# EAGLE schematic PCB_control_glider_v21 (EAGLE 9.7.0)
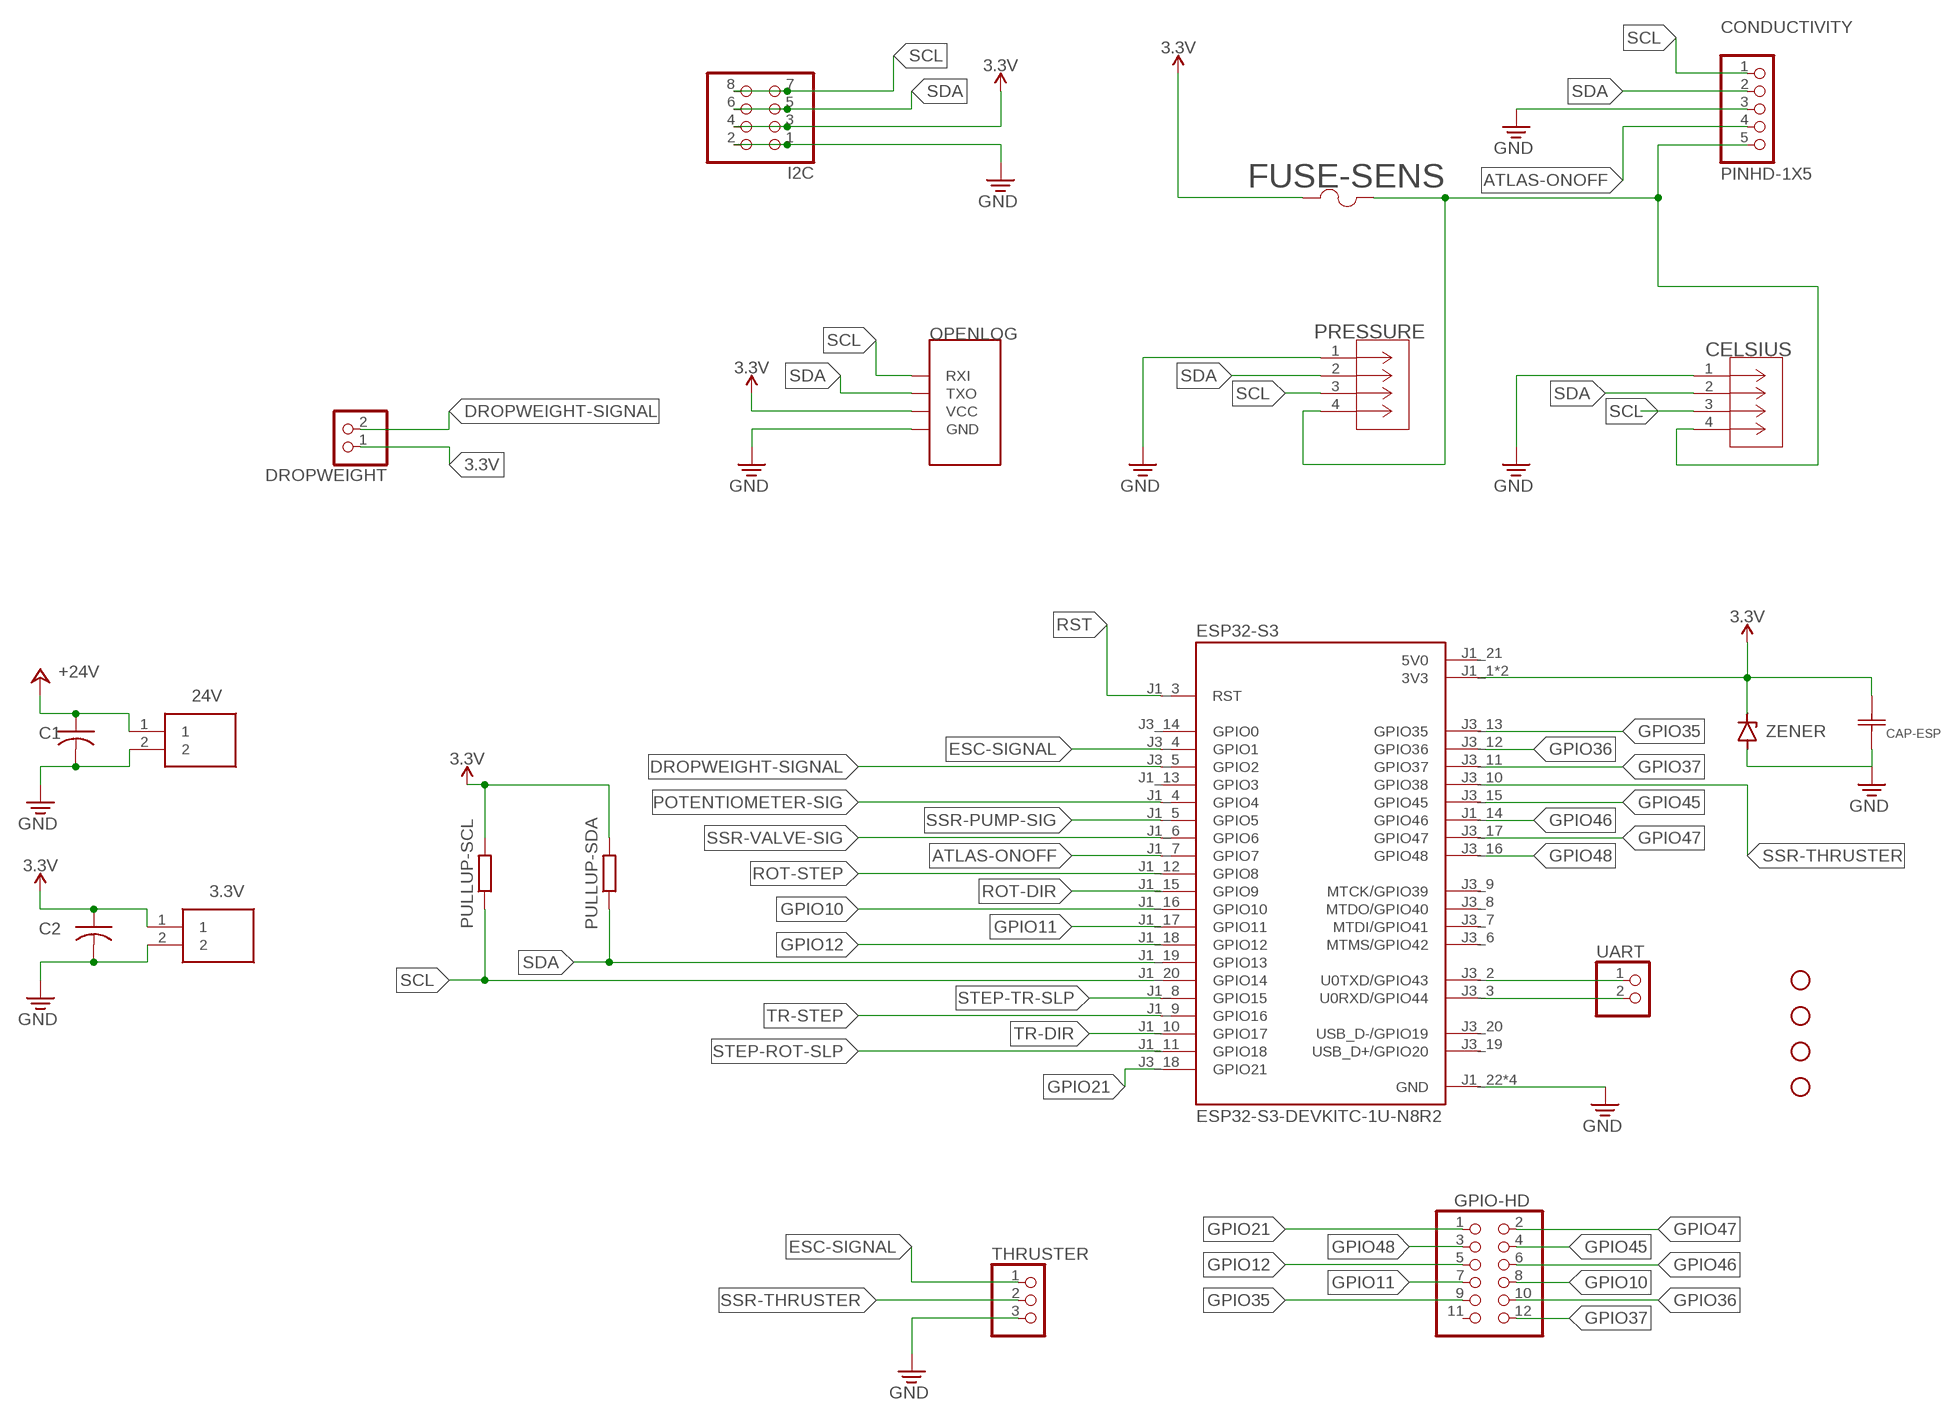
[diagram p0: schematic, sheet 1, part 1 of 2]
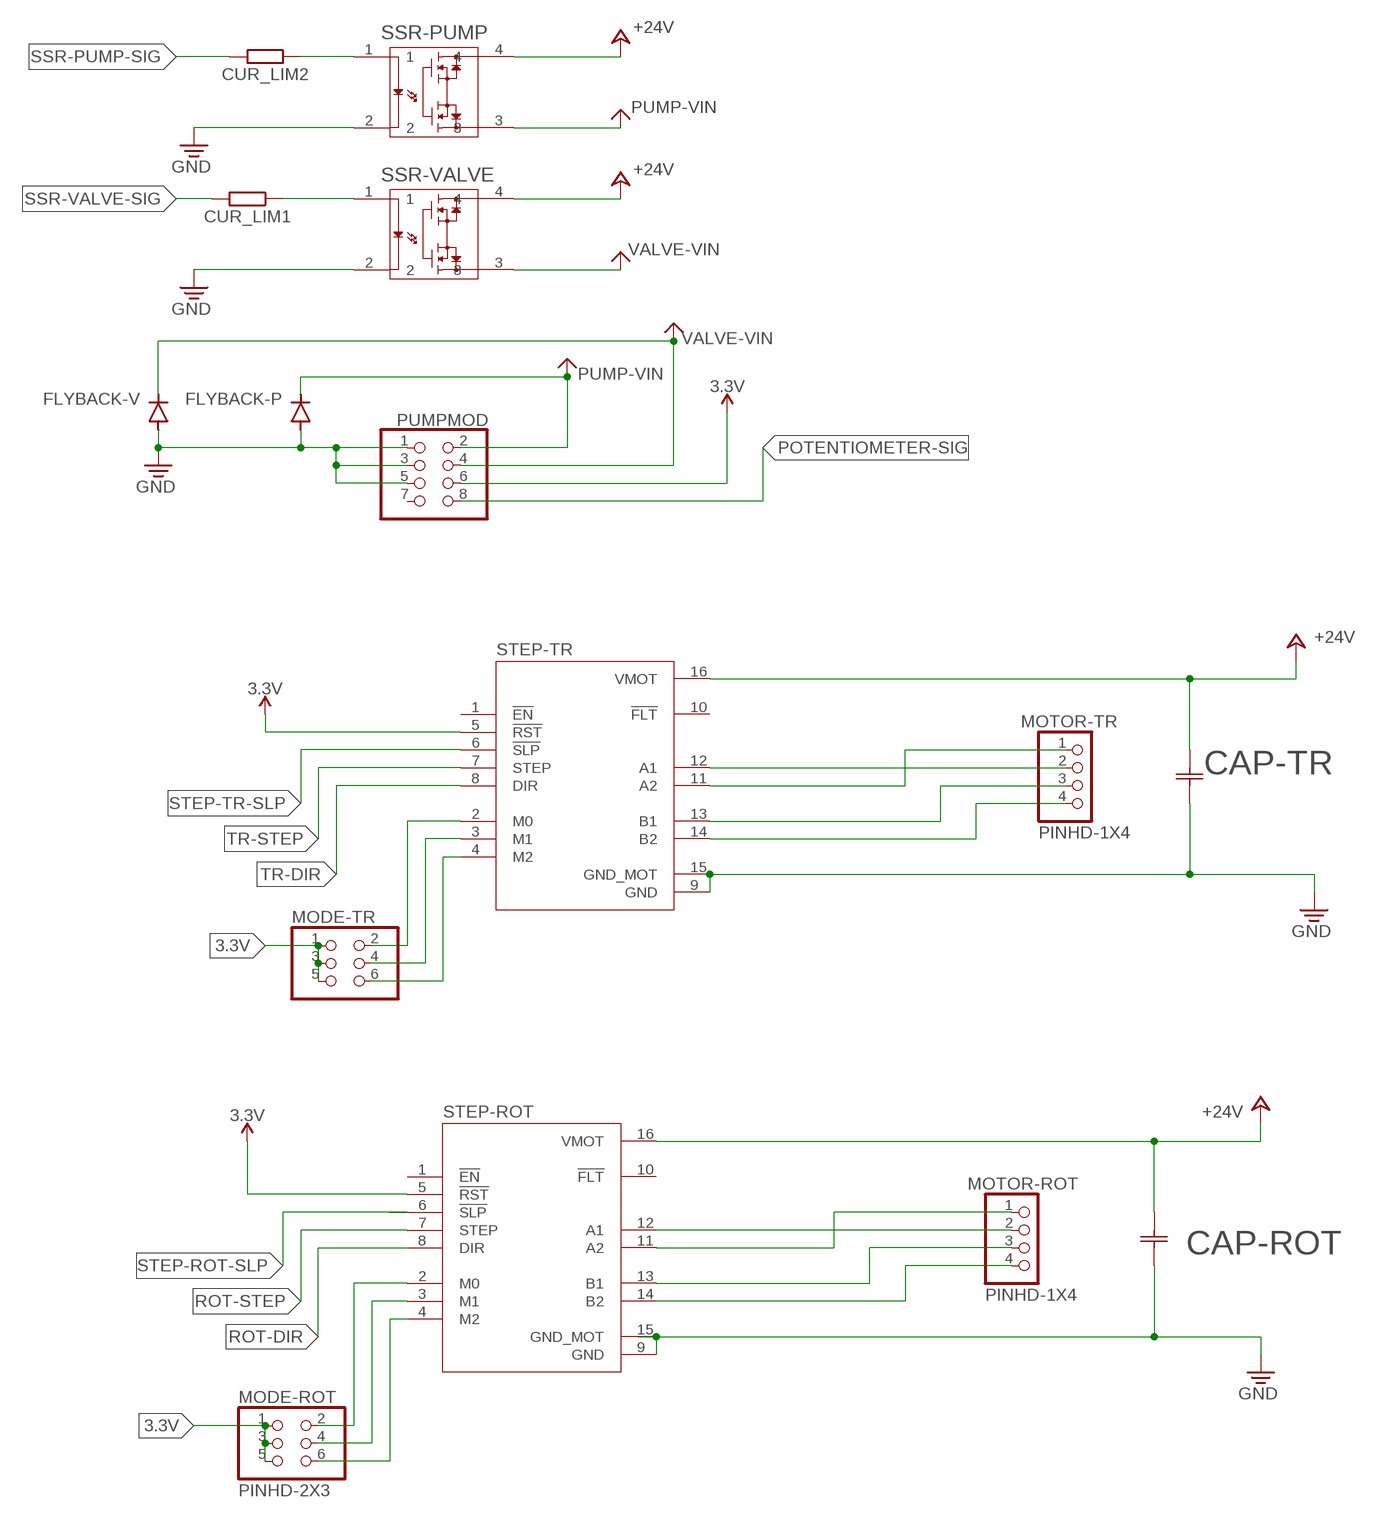
[diagram p1: schematic, sheet 1, part 2 of 2]

## Parts
3.3V  CTBP0508_2  [CTBP05082]
24V  CTBP0508_2  [CTBP05082]
C1  ECA-1HM100  [CAP_RADIAL_2MM]
C2  ECA-1HM100  [CAP_RADIAL_2MM]
CAP-ESP  EEUHD1H101BCAP_PAN_8X11.5_PAN  [CAP_PAN_8X11.5_PAN]
CAP-ROT  EEUHD1H101BCAP_PAN_8X11.5_PAN  [CAP_PAN_8X11.5_PAN]
CAP-TR  EEUHD1H101BCAP_PAN_8X11.5_PAN  [CAP_PAN_8X11.5_PAN]
CELSIUS  BM04B-GHS-TBTCONN_BM04B-GHS-TBT_JST  [CONN_BM04B-GHS-TBT_JST]
CONDUCTIVITY  PINHD-1X5  [1X05]
CUR_LIM1  RESISTOR-BACKUP_AXIAL-10.16MM-PITCH  [RESAD1016W63L850D250B]
CUR_LIM2  RESISTOR-BACKUP_AXIAL-10.16MM-PITCH  [RESAD1016W63L850D250B]
DROPWEIGHT  PINHD-1X2  [1X02]
ESP32-S3  ESP32-S3-DEVKITC-1U-N8R2  [XCVR_ESP32-S3-DEVKITC-1U-N8R2]
FLYBACK-P  1N4004  [DO-41]
FLYBACK-V  1N4004  [DO-41]
FUSE-SENS  LVR033KFUS_LVR033_TYCO_TYC  [FUS_LVR033_TYCO_TYC]
GPIO-HD  PINHD-2X6  [2X06]
H1  STAND-OFFTIGHT  [STAND-OFF-TIGHT]
H2  STAND-OFFTIGHT  [STAND-OFF-TIGHT]
H3  STAND-OFFTIGHT  [STAND-OFF-TIGHT]
H4  STAND-OFFTIGHT  [STAND-OFF-TIGHT]
I2C  PINHD-2X4  [2X04]
MODE-ROT  PINHD-2X3  [2X03]
MODE-TR  PINHD-2X3  [2X03]
MOTOR-ROT  PINHD-1X4  [1X04]
MOTOR-TR  PINHD-1X4  [1X04]
PRESSURE  BM04B-GHS-TBTCONN_BM04B-GHS-TBT_JST  [CONN_BM04B-GHS-TBT_JST]
PULLUP-SCL  RESISTOR-BACKUP_AXIAL-10.16MM-PITCH  [RESAD1016W63L850D250B]
PULLUP-SDA  RESISTOR-BACKUP_AXIAL-10.16MM-PITCH  [RESAD1016W63L850D250B]
PUMPMOD  PINHD-2X4  [2X04]
QWIIC-OPENLOG  OPENLOG  [OPENLOG]
SSR-PUMP  G3VM-61ARA-DIP4_THD_OMR  [A-DIP4_THD_OMR]
SSR-VALVE  G3VM-61ARA-DIP4_THD_OMR  [A-DIP4_THD_OMR]
STEP-ROT  DRV8825_STEPPER_MOTOR_DRIVER_CARRIER  [IC_DRV8825_STEPPER_MOTOR_DRIVER_CARRIER]
STEP-TR  DRV8825_STEPPER_MOTOR_DRIVER_CARRIER  [IC_DRV8825_STEPPER_MOTOR_DRIVER_CARRIER]
THRUSTER  PINHD-1X3  [1X03]
UART  PINHD-1X2  [1X02]
ZENER  ZENER_DIODE-AXIAL  [DIODE-AXIAL]

## Nets
3.3V: 3.3V.1 C2.1 CAP-ESP.1 DROPWEIGHT.1 ESP32-S3.J1_1(3V3) ESP32-S3.J1_2(3V3) FUSE-SENS.1 I2C.3 I2C.4 MODE-ROT.1 MODE-ROT.3 MODE-ROT.5 MODE-TR.1 MODE-TR.3 MODE-TR.5 PULLUP-SCL.2 PULLUP-SDA.2 PUMPMOD.6 QWIIC-OPENLOG.VCC STEP-ROT.5(!RST) STEP-TR.5(!RST) ZENER.2(C)
+24V: 24V.1 C1.1 CAP-ROT.1 CAP-TR.1 SSR-PUMP.4 SSR-VALVE.4 STEP-ROT.16(VMOT) STEP-TR.16(VMOT)
ATLAS-ONOFF: CONDUCTIVITY.4 ESP32-S3.J1_7(GPIO7)
DROPWEIGHT-SIGNAL: DROPWEIGHT.2 ESP32-S3.J3_5(GPIO2)
ESC-SIGNAL: ESP32-S3.J3_4(GPIO1) THRUSTER.1
GND [New Class]: 3.3V.2 24V.2 C1.2 C2.2 CAP-ESP.2 CAP-ROT.2 CAP-TR.2 CELSIUS.1 CONDUCTIVITY.3 ESP32-S3.J1_22(GND) ESP32-S3.J3_1(GND) ESP32-S3.J3_21(GND) ESP32-S3.J3_22(GND) FLYBACK-P.A FLYBACK-V.A I2C.1 I2C.2 PRESSURE.1 PUMPMOD.1 PUMPMOD.3 PUMPMOD.5 QWIIC-OPENLOG.GND SSR-PUMP.2 SSR-VALVE.2 STEP-ROT.9(GND) STEP-ROT.15(GND_MOT) STEP-TR.9(GND) STEP-TR.15(GND_MOT) THRUSTER.3 ZENER.1(A)
GPIO10: ESP32-S3.J1_16(GPIO10) GPIO-HD.8
GPIO11: ESP32-S3.J1_17(GPIO11) GPIO-HD.7
GPIO12: ESP32-S3.J1_18(GPIO12) GPIO-HD.5
GPIO21: ESP32-S3.J3_18(GPIO21) GPIO-HD.1
GPIO35: ESP32-S3.J3_13(GPIO35) GPIO-HD.9
GPIO36: ESP32-S3.J3_12(GPIO36) GPIO-HD.10
GPIO37: ESP32-S3.J3_11(GPIO37) GPIO-HD.12
GPIO45: ESP32-S3.J3_15(GPIO45) GPIO-HD.4
GPIO46: ESP32-S3.J1_14(GPIO46) GPIO-HD.6
GPIO47: ESP32-S3.J3_17(GPIO47) GPIO-HD.2
GPIO48: ESP32-S3.J3_16(GPIO48) GPIO-HD.3
N$1: ESP32-S3.J3_2(U0TXD/GPIO43) UART.1
N$3: ESP32-S3.J3_3(U0RXD/GPIO44) UART.2
N$4: MODE-TR.2 STEP-TR.2(M0)
N$5: MODE-TR.4 STEP-TR.3(M1)
N$6: MODE-TR.6 STEP-TR.4(M2)
N$7: CELSIUS.4 CONDUCTIVITY.5 FUSE-SENS.2 PRESSURE.4
N$8: MODE-ROT.2 STEP-ROT.2(M0)
N$10: MODE-ROT.6 STEP-ROT.4(M2)
N$12: MODE-ROT.4 STEP-ROT.3(M1)
N$13: CUR_LIM2.1 SSR-PUMP.1
N$14: CUR_LIM1.1 SSR-VALVE.1
POTENTIOMETER-SIG: ESP32-S3.J1_4(GPIO4) PUMPMOD.8
PUMP-VIN: FLYBACK-P.C PUMPMOD.2 SSR-PUMP.3
R-A1: MOTOR-ROT.2 STEP-ROT.12(A1)
R-A2: MOTOR-ROT.1 STEP-ROT.11(A2)
R-B1: MOTOR-ROT.3 STEP-ROT.13(B1)
R-B2: MOTOR-ROT.4 STEP-ROT.14(B2)
ROT-DIR: ESP32-S3.J1_15(GPIO9) STEP-ROT.8(DIR)
ROT-STEP: ESP32-S3.J1_12(GPIO8) STEP-ROT.7(STEP)
RST: ESP32-S3.J1_3(RST)
SCL: CELSIUS.3 CONDUCTIVITY.1 ESP32-S3.J1_20(GPIO14) I2C.7 I2C.8 PRESSURE.3 PULLUP-SCL.1 QWIIC-OPENLOG.RXI
SDA: CELSIUS.2 CONDUCTIVITY.2 ESP32-S3.J1_19(GPIO13) I2C.5 I2C.6 PRESSURE.2 PULLUP-SDA.1 QWIIC-OPENLOG.TXO
SSR-PUMP-SIG: CUR_LIM2.2 ESP32-S3.J1_5(GPIO5)
SSR-THRUSTER: ESP32-S3.J3_10(GPIO38) THRUSTER.2
SSR-VALVE-SIG: CUR_LIM1.2 ESP32-S3.J1_6(GPIO6)
STEP-ROT-SLP: ESP32-S3.J1_11(GPIO18) STEP-ROT.6(!SLP)
STEP-TR-SLP: ESP32-S3.J1_8(GPIO15) STEP-TR.6(!SLP)
T-A1: MOTOR-TR.2 STEP-TR.12(A1)
T-A2: MOTOR-TR.1 STEP-TR.11(A2)
T-B1: MOTOR-TR.3 STEP-TR.13(B1)
T-B2: MOTOR-TR.4 STEP-TR.14(B2)
TR-DIR: ESP32-S3.J1_10(GPIO17) STEP-TR.8(DIR)
TR-STEP: ESP32-S3.J1_9(GPIO16) STEP-TR.7(STEP)
VALVE-VIN: FLYBACK-V.C PUMPMOD.4 SSR-VALVE.3
Unconnected: ESP32-S3.J1_13(GPIO3) ESP32-S3.J3_6(MTMS/GPIO42) ESP32-S3.J3_7(MTDI/GPIO41) ESP32-S3.J3_8(MTDO/GPIO40) ESP32-S3.J3_9(MTCK/GPIO39) ESP32-S3.J3_14(GPIO0) ESP32-S3.J3_19(USB_D+/GPIO20) ESP32-S3.J3_20(USB_D-/GPIO19) GPIO-HD.11 PUMPMOD.7 STEP-ROT.1(!EN) STEP-ROT.10(!FLT) STEP-TR.1(!EN) STEP-TR.10(!FLT)

## Power pins joined to a net without a drawn wire
5V0: ESP32-S3.J1_21(5V0)

## Library data of the parts
3.3V 24V = CTBP0508_2:CTBP0508_2: Conn Terminal Block F 2 POS 5.08mm Solder ST Thru-Hole 8A Source: Datasheet <https://static6.arrow.com/aropdfconversion/9b5fc771929c7e0117b52de15994f93b42c84896/ctbp0508_series_d.pdf>; DESCRIPTION: Conn Terminal Block F 2 POS 5.08mm Solder ST Thru-Hole 8A; HEIGHT: 10.2mm; MANUFACTURER_NAME: CAMDENBOSS; MANUFACTURER_PART_NUMBER: CTBP0508/2
C1 C2 = Resistor_Capacitor:ECA-1HM100: CAP ALUM 10UF 20% 50V RADIAL Manufacturer's datasheet <https://media.digikey.com/pdf/Data%20Sheets/Panasonic%20Electronic%20Components/ECA-xxM%20Series,TypeA.pdf>; CREATED_BY: PCBLayout.com; DIGIKEY_PART_NUMBER: P5178-ND; MANUFACTURER: Panasonic Electronic Components; MPN: ECA-1HM100; PACKAGE: CAP RADIAL 2MM LS
CAP-ESP CAP-ROT CAP-TR = 100uf-50V-electrolytic_Library:EEUHD1H101B; COPYRIGHT: Copyright (C) 2024 Ultra Librarian. All rights reserved.; MANUFACTURER_PART_NUMBER: EEUHD1H101B; MFR_NAME: Panasonic
CELSIUS PRESSURE = BM04B_GHS_TBT_Library:BM04B-GHS-TBT; COPYRIGHT: Copyright (C) 2024 Ultra Librarian. All rights reserved.; MANUFACTURER_PART_NUMBER: BM04B-GHS-TBT; MFR_NAME: JST
CONDUCTIVITY = Connector:PINHD-1X5: PIN HEADER; CATEGORY: Headers; DESCRIPTION: Header, Straight, 5 Position; MANUFACTURER: Generic; MPN: Generic; OPERATING_TEMPERATURE: Generic; PART_STATUS: Active; PITCH: 0.100" (2.54mm); ROHS_COMPLIANCE: Generic; SERIES: Generic; SUB-CATEGORY: Headers, Male Pins; TYPE: Board to Board or Cable, Unshrouded, Through Hole, Straight
CUR_LIM1 CUR_LIM2 PULLUP-SCL PULLUP-SDA = Tinkercad:RESISTOR-BACKUP: Resistor Fixed - Generic
DROPWEIGHT UART = Airquality_Sensor:PINHD-1X2: PIN HEADER
ESP32-S3 = ESP32-S3-DEVKITC-1U-N8R2:ESP32-S3-DEVKITC-1U-N8R2: Check availability <https://pricing.snapeda.com/parts/ESP32-S3-DEVKITC-1U-N8R2/Espressif%20Systems/view-part?ref=eda>; AVAILABILITY: In Stock; CHECK_PRICES: https://www.snapeda.com/parts/ESP32-S3-DEVKITC-1U-N8R2/Espressif+Systems/view-part/?ref=eda; DESCRIPTION: WiFi Development Tools - 802.11 ESP32-S3 Gen-Purpose Dev Bd, embeds ESP32-S3-WROOM-1U-N8R2, 8 MB Quad Flash, 2 MB Quad PSRAM, IPEX antenna connector, w/ Pin Header; MF: Espressif Systems; MP: ESP32-S3-DEVKITC-1U-N8R2; PACKAGE: None; PRICE: None; PURCHASE-URL: https://www.snapeda.com/api/url_track_click_mouser/?unipart_id=12089198&manufacturer=Espressif Systems&part_name=ESP32-S3-DEVKITC-1U-N8R2&search_term=esp32-s3-devkitc; SNAPEDA_LINK: https://www.snapeda.com/parts/ESP32-S3-DEVKITC-1U-N8R2/Espressif+Systems/view-part/?ref=snap
FLYBACK-P FLYBACK-V = Diodes:1N4004: DIODE GEN PURP 400V 1A DO41 Manufacturer's datasheet <https://www.mccsemi.com/pdf/Products/1N4001-1N4007(DO-41).pdf>; CREATED_BY: PCBLayout.com; DIGIKEY_PART_NUMBER: 1N4004MSCT-ND; MANUFACTURER: Micro Commercial Co; MPN: 1N4004; PACKAGE: DO-41
FUSE-SENS = LVR033K-fuse_Library:LVR033K; COPYRIGHT: Copyright (C) 2024 Ultra Librarian. All rights reserved.; MANUFACTURER_PART_NUMBER: LVR033K; MFR_NAME: TE Connectivity
GPIO-HD = Connector:PINHD-2X6: PIN HEADER; CATEGORY: Headers; DESCRIPTION: Header, Straight, 2x6 Position; MANUFACTURER: Generic; MPN: Generic; OPERATING_TEMPERATURE: Generic; PART_STATUS: Active; PITCH: 0.100" (2.54mm); ROHS_COMPLIANCE: Generic; SERIES: Generic; SUB-CATEGORY: Headers, Male Pins; TYPE: Board to Board or Cable, Unshrouded, Through Hole, Straight
H1-H4 = SparkFun-Hardware:STAND-OFF: Stand Off Drill holes for mechanically mounting via screws, standoffs, etc. Note: Use the keepout ring to avoid running the screw head into surrounding components. Variant Overviews STAND-OFF - Mechanical footprint for a #4 phillips button head screw. STAND-OFF-TIGHT - Mechanical footprint for a #4 phillips button head screw, Example SparkFun Products Screw - Phillips Head (1/4", 4-40, 10 pack) <https://www.sparkfun.com/products/10453> (PRT-10453) Screw - Phillips Head (1/2", 4-40, 10 pack) <https://www.sparkfun.com/products/10452> (PRT-10452) Screw - Phillips Head (3/4", 4-40, 10 pack) <https://www.sparkfun.com/products/10451> (PRT-10451) Screw - Phillips Head (1", 4-40, 10 pack) <https://www.sparkfun.com/products/10450> (PRT-10450)
I2C PUMPMOD = adafruit:PINHD-2X4: PIN HEADER
MODE-ROT MODE-TR = Connector:PINHD-2X3: PIN HEADER; CATEGORY: Headers; DESCRIPTION: Header, Straight, 2x3 Position; MANUFACTURER: Generic; MPN: Generic; OPERATING_TEMPERATURE: Generic; PART_STATUS: Active; PITCH: 0.100" (2.54mm); ROHS_COMPLIANCE: Generic; SERIES: Generic; SUB-CATEGORY: Headers, Male Pins; TYPE: Board to Board or Cable, Unshrouded, Through Hole, Straight
MOTOR-ROT MOTOR-TR = Connector:PINHD-1X4: PIN HEADER; CATEGORY: Headers; DESCRIPTION: Header, Straight, 4 Position; MANUFACTURER: Generic; MPN: Generic; OPERATING_TEMPERATURE: Generic; PART_STATUS: Active; PITCH: 0.100" (2.54mm); ROHS_COMPLIANCE: Generic; SERIES: Generic; SUB-CATEGORY: Headers, Male Pins; TYPE: Board to Board or Cable, Unshrouded, Through Hole, Straight
QWIIC-OPENLOG = OpenLog qwiic:OPENLOG
SSR-PUMP SSR-VALVE = g3vm-61ar:G3VM-61AR; COPYRIGHT: Copyright (C) 2024 Ultra Librarian. All rights reserved.; MANUFACTURER_PART_NUMBER: G3VM-61AR; MFR_NAME: Omron
STEP-ROT STEP-TR = DRV8825_STEPPER_MOTOR_DRIVER_CARRIER:DRV8825_STEPPER_MOTOR_DRIVER_CARRIER: Stepper motor controler; IC: DRV8825; 1.5A; Uin mot: 8.2÷45V Check availability <https://pricing.snapeda.com/parts/DRV8825%20STEPPER%20MOTOR%20DRIVER%20CARRIER/Pololu/view-part?ref=eda>; AVAILABILITY: Not in stock; CHECK_PRICES: https://www.snapeda.com/parts/DRV8825%20STEPPER%20MOTOR%20DRIVER%20CARRIER/Pololu/view-part/?ref=eda; DESCRIPTION: Stepper, Bipolar 8.2 ~ 45VDC Supply 1.5A 8.2 ~ 45V Load; MF: Pololu; MP: DRV8825 STEPPER MOTOR DRIVER CARRIER; PACKAGE: None; PRICE: None; SNAPEDA_LINK: https://www.snapeda.com/parts/DRV8825%20STEPPER%20MOTOR%20DRIVER%20CARRIER/Pololu/view-part/?ref=snap
THRUSTER = pinhead:PINHD-1X3: PIN HEADER
ZENER = Tinkercad:ZENER: Zener Diode - Generic